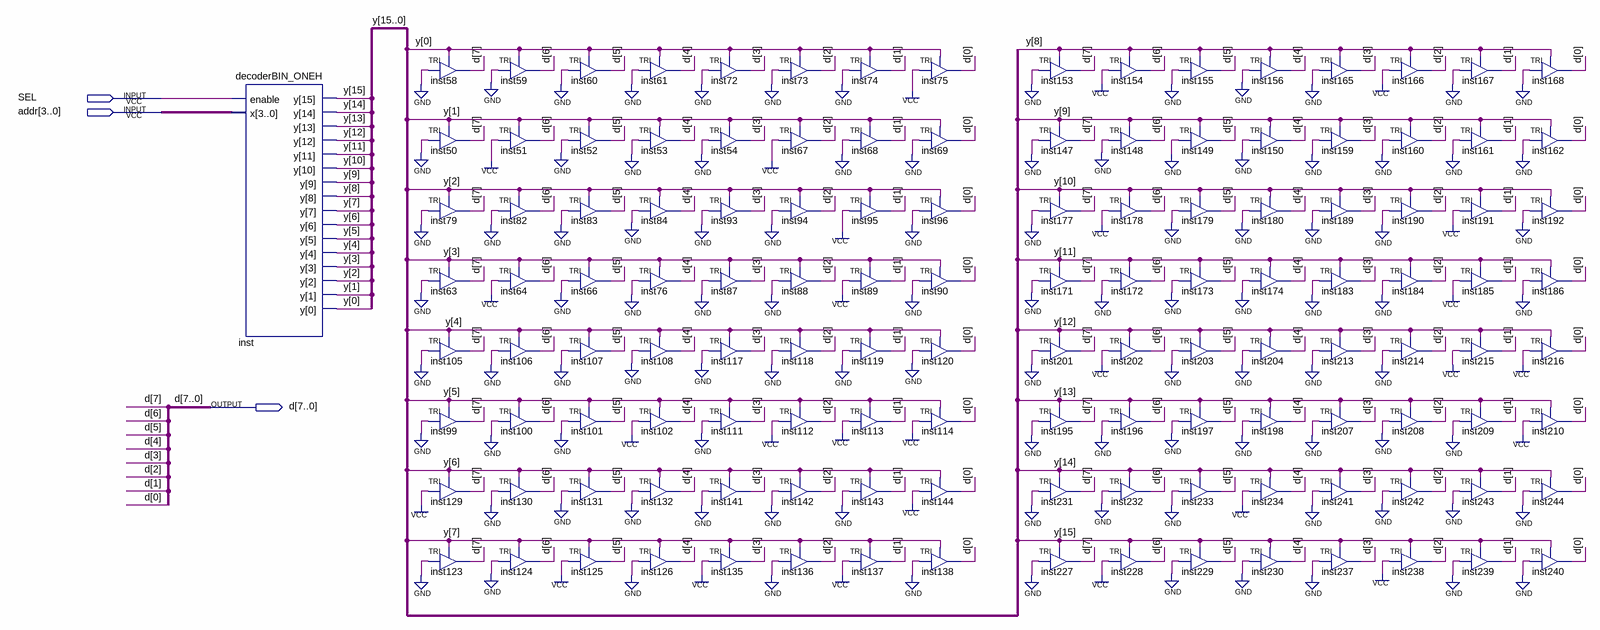
[diagram p0: schematic sheet]
// Quartus schematic rom16x8_31.bdf as structural Verilog: 129 symbols, 3 pins
module rom16x8_31 (
  input  SEL,
  input  [3:0] addr,
  output [7:0] d
);

  wire [15:0] y;

  decoderBIN_ONEH inst (.enable(SEL), .x(addr), .y(y));
  TRI inst58 (.IN(1'b0), .OE(y[0]), .OUT(d[7]));
  TRI inst50 (.IN(1'b0), .OE(y[1]), .OUT(d[7]));
  TRI inst79 (.IN(1'b0), .OE(y[2]), .OUT(d[7]));
  TRI inst63 (.IN(1'b0), .OE(y[3]), .OUT(d[7]));
  TRI inst105 (.IN(1'b0), .OE(y[4]), .OUT(d[7]));
  TRI inst99 (.IN(1'b0), .OE(y[5]), .OUT(d[7]));
  TRI inst129 (.IN(1'b1), .OE(y[6]), .OUT(d[7]));
  TRI inst123 (.IN(1'b0), .OE(y[7]), .OUT(d[7]));
  TRI inst59 (.IN(1'b0), .OE(y[0]), .OUT(d[6]));
  TRI inst51 (.IN(1'b1), .OE(y[1]), .OUT(d[6]));
  TRI inst82 (.IN(1'b0), .OE(y[2]), .OUT(d[6]));
  TRI inst64 (.IN(1'b1), .OE(y[3]), .OUT(d[6]));
  TRI inst106 (.IN(1'b0), .OE(y[4]), .OUT(d[6]));
  TRI inst100 (.IN(1'b0), .OE(y[5]), .OUT(d[6]));
  TRI inst130 (.IN(1'b0), .OE(y[6]), .OUT(d[6]));
  TRI inst124 (.IN(1'b0), .OE(y[7]), .OUT(d[6]));
  TRI inst60 (.IN(1'b0), .OE(y[0]), .OUT(d[5]));
  TRI inst52 (.IN(1'b0), .OE(y[1]), .OUT(d[5]));
  TRI inst83 (.IN(1'b0), .OE(y[2]), .OUT(d[5]));
  TRI inst66 (.IN(1'b0), .OE(y[3]), .OUT(d[5]));
  TRI inst107 (.IN(1'b0), .OE(y[4]), .OUT(d[5]));
  TRI inst101 (.IN(1'b0), .OE(y[5]), .OUT(d[5]));
  TRI inst131 (.IN(1'b0), .OE(y[6]), .OUT(d[5]));
  TRI inst125 (.IN(1'b1), .OE(y[7]), .OUT(d[5]));
  TRI inst61 (.IN(1'b0), .OE(y[0]), .OUT(d[4]));
  TRI inst53 (.IN(1'b0), .OE(y[1]), .OUT(d[4]));
  TRI inst84 (.IN(1'b0), .OE(y[2]), .OUT(d[4]));
  TRI inst76 (.IN(1'b0), .OE(y[3]), .OUT(d[4]));
  TRI inst108 (.IN(1'b0), .OE(y[4]), .OUT(d[4]));
  TRI inst102 (.IN(1'b1), .OE(y[5]), .OUT(d[4]));
  TRI inst132 (.IN(1'b0), .OE(y[6]), .OUT(d[4]));
  TRI inst126 (.IN(1'b0), .OE(y[7]), .OUT(d[4]));
  TRI inst72 (.IN(1'b0), .OE(y[0]), .OUT(d[3]));
  TRI inst54 (.IN(1'b0), .OE(y[1]), .OUT(d[3]));
  TRI inst93 (.IN(1'b0), .OE(y[2]), .OUT(d[3]));
  TRI inst87 (.IN(1'b0), .OE(y[3]), .OUT(d[3]));
  TRI inst117 (.IN(1'b0), .OE(y[4]), .OUT(d[3]));
  TRI inst111 (.IN(1'b0), .OE(y[5]), .OUT(d[3]));
  TRI inst141 (.IN(1'b0), .OE(y[6]), .OUT(d[3]));
  TRI inst135 (.IN(1'b1), .OE(y[7]), .OUT(d[3]));
  TRI inst73 (.IN(1'b0), .OE(y[0]), .OUT(d[2]));
  TRI inst67 (.IN(1'b1), .OE(y[1]), .OUT(d[2]));
  TRI inst94 (.IN(1'b0), .OE(y[2]), .OUT(d[2]));
  TRI inst88 (.IN(1'b0), .OE(y[3]), .OUT(d[2]));
  TRI inst118 (.IN(1'b0), .OE(y[4]), .OUT(d[2]));
  TRI inst112 (.IN(1'b1), .OE(y[5]), .OUT(d[2]));
  TRI inst142 (.IN(1'b0), .OE(y[6]), .OUT(d[2]));
  TRI inst136 (.IN(1'b0), .OE(y[7]), .OUT(d[2]));
  TRI inst74 (.IN(1'b0), .OE(y[0]), .OUT(d[1]));
  TRI inst68 (.IN(1'b0), .OE(y[1]), .OUT(d[1]));
  TRI inst95 (.IN(1'b1), .OE(y[2]), .OUT(d[1]));
  TRI inst89 (.IN(1'b1), .OE(y[3]), .OUT(d[1]));
  TRI inst119 (.IN(1'b0), .OE(y[4]), .OUT(d[1]));
  TRI inst113 (.IN(1'b1), .OE(y[5]), .OUT(d[1]));
  TRI inst143 (.IN(1'b0), .OE(y[6]), .OUT(d[1]));
  TRI inst137 (.IN(1'b1), .OE(y[7]), .OUT(d[1]));
  TRI inst75 (.IN(1'b1), .OE(y[0]), .OUT(d[0]));
  TRI inst69 (.IN(1'b0), .OE(y[1]), .OUT(d[0]));
  TRI inst96 (.IN(1'b0), .OE(y[2]), .OUT(d[0]));
  TRI inst90 (.IN(1'b0), .OE(y[3]), .OUT(d[0]));
  TRI inst120 (.IN(1'b0), .OE(y[4]), .OUT(d[0]));
  TRI inst114 (.IN(1'b1), .OE(y[5]), .OUT(d[0]));
  TRI inst144 (.IN(1'b1), .OE(y[6]), .OUT(d[0]));
  TRI inst138 (.IN(1'b0), .OE(y[7]), .OUT(d[0]));
  TRI inst153 (.IN(1'b0), .OE(y[8]), .OUT(d[7]));
  TRI inst147 (.IN(1'b0), .OE(y[9]), .OUT(d[7]));
  TRI inst177 (.IN(1'b0), .OE(y[10]), .OUT(d[7]));
  TRI inst171 (.IN(1'b0), .OE(y[11]), .OUT(d[7]));
  TRI inst201 (.IN(1'b0), .OE(y[12]), .OUT(d[7]));
  TRI inst195 (.IN(1'b0), .OE(y[13]), .OUT(d[7]));
  TRI inst231 (.IN(1'b0), .OE(y[14]), .OUT(d[7]));
  TRI inst227 (.IN(1'b0), .OE(y[15]), .OUT(d[7]));
  TRI inst154 (.IN(1'b1), .OE(y[8]), .OUT(d[6]));
  TRI inst148 (.IN(1'b0), .OE(y[9]), .OUT(d[6]));
  TRI inst178 (.IN(1'b1), .OE(y[10]), .OUT(d[6]));
  TRI inst172 (.IN(1'b0), .OE(y[11]), .OUT(d[6]));
  TRI inst202 (.IN(1'b1), .OE(y[12]), .OUT(d[6]));
  TRI inst196 (.IN(1'b0), .OE(y[13]), .OUT(d[6]));
  TRI inst232 (.IN(1'b0), .OE(y[14]), .OUT(d[6]));
  TRI inst228 (.IN(1'b1), .OE(y[15]), .OUT(d[6]));
  TRI inst155 (.IN(1'b0), .OE(y[8]), .OUT(d[5]));
  TRI inst149 (.IN(1'b0), .OE(y[9]), .OUT(d[5]));
  TRI inst179 (.IN(1'b0), .OE(y[10]), .OUT(d[5]));
  TRI inst173 (.IN(1'b0), .OE(y[11]), .OUT(d[5]));
  TRI inst203 (.IN(1'b0), .OE(y[12]), .OUT(d[5]));
  TRI inst197 (.IN(1'b0), .OE(y[13]), .OUT(d[5]));
  TRI inst233 (.IN(1'b0), .OE(y[14]), .OUT(d[5]));
  TRI inst229 (.IN(1'b0), .OE(y[15]), .OUT(d[5]));
  TRI inst156 (.IN(1'b0), .OE(y[8]), .OUT(d[4]));
  TRI inst150 (.IN(1'b0), .OE(y[9]), .OUT(d[4]));
  TRI inst180 (.IN(1'b0), .OE(y[10]), .OUT(d[4]));
  TRI inst174 (.IN(1'b0), .OE(y[11]), .OUT(d[4]));
  TRI inst204 (.IN(1'b0), .OE(y[12]), .OUT(d[4]));
  TRI inst198 (.IN(1'b0), .OE(y[13]), .OUT(d[4]));
  TRI inst234 (.IN(1'b1), .OE(y[14]), .OUT(d[4]));
  TRI inst230 (.IN(1'b0), .OE(y[15]), .OUT(d[4]));
  TRI inst165 (.IN(1'b0), .OE(y[8]), .OUT(d[3]));
  TRI inst159 (.IN(1'b0), .OE(y[9]), .OUT(d[3]));
  TRI inst189 (.IN(1'b0), .OE(y[10]), .OUT(d[3]));
  TRI inst183 (.IN(1'b0), .OE(y[11]), .OUT(d[3]));
  TRI inst213 (.IN(1'b0), .OE(y[12]), .OUT(d[3]));
  TRI inst207 (.IN(1'b0), .OE(y[13]), .OUT(d[3]));
  TRI inst241 (.IN(1'b0), .OE(y[14]), .OUT(d[3]));
  TRI inst237 (.IN(1'b0), .OE(y[15]), .OUT(d[3]));
  TRI inst166 (.IN(1'b1), .OE(y[8]), .OUT(d[2]));
  TRI inst160 (.IN(1'b0), .OE(y[9]), .OUT(d[2]));
  TRI inst190 (.IN(1'b0), .OE(y[10]), .OUT(d[2]));
  TRI inst184 (.IN(1'b0), .OE(y[11]), .OUT(d[2]));
  TRI inst214 (.IN(1'b0), .OE(y[12]), .OUT(d[2]));
  TRI inst208 (.IN(1'b0), .OE(y[13]), .OUT(d[2]));
  TRI inst242 (.IN(1'b0), .OE(y[14]), .OUT(d[2]));
  TRI inst238 (.IN(1'b1), .OE(y[15]), .OUT(d[2]));
  TRI inst167 (.IN(1'b0), .OE(y[8]), .OUT(d[1]));
  TRI inst161 (.IN(1'b0), .OE(y[9]), .OUT(d[1]));
  TRI inst191 (.IN(1'b1), .OE(y[10]), .OUT(d[1]));
  TRI inst185 (.IN(1'b1), .OE(y[11]), .OUT(d[1]));
  TRI inst215 (.IN(1'b1), .OE(y[12]), .OUT(d[1]));
  TRI inst209 (.IN(1'b0), .OE(y[13]), .OUT(d[1]));
  TRI inst243 (.IN(1'b0), .OE(y[14]), .OUT(d[1]));
  TRI inst239 (.IN(1'b0), .OE(y[15]), .OUT(d[1]));
  TRI inst168 (.IN(1'b0), .OE(y[8]), .OUT(d[0]));
  TRI inst162 (.IN(1'b0), .OE(y[9]), .OUT(d[0]));
  TRI inst192 (.IN(1'b0), .OE(y[10]), .OUT(d[0]));
  TRI inst186 (.IN(1'b0), .OE(y[11]), .OUT(d[0]));
  TRI inst216 (.IN(1'b1), .OE(y[12]), .OUT(d[0]));
  TRI inst210 (.IN(1'b1), .OE(y[13]), .OUT(d[0]));
  TRI inst244 (.IN(1'b0), .OE(y[14]), .OUT(d[0]));
  TRI inst240 (.IN(1'b0), .OE(y[15]), .OUT(d[0]));
endmodule
